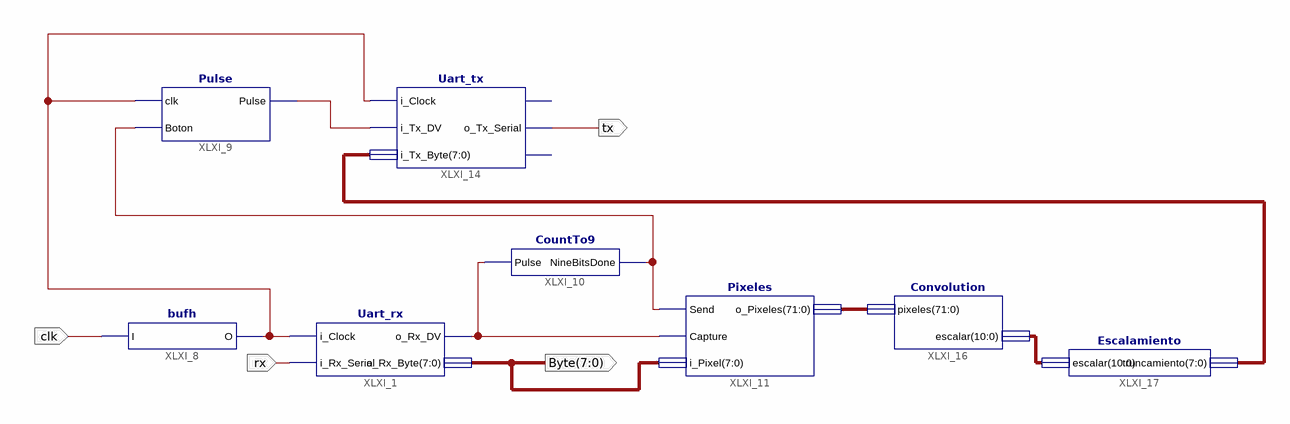
[diagram p0: schematic sheet 1]
// Xilinx ISE schematic Procesamiento.sch (spartan6) as structural Verilog: 8 symbols, 4 ports
module Procesamiento (
  input  rx,
  input  clk,
  output [7:0] Byte,
  output tx
);

  wire btn, Interrupt, XLXN_9, XLXN_10;
  wire [7:0] XLXN_21;
  wire [10:0] XLXN_22;
  wire [71:0] XLXN_16;

  Uart_rx XLXI_1 (.i_Clock(XLXN_9), .i_Rx_Serial(rx), .o_Rx_DV(Interrupt), .o_Rx_Byte(Byte));
  bufh XLXI_8 (.I(clk), .O(XLXN_9));
  Pulse XLXI_9 (.clk(XLXN_9), .Boton(btn), .Pulse(XLXN_10));
  CountTo9 XLXI_10 (.Pulse(Interrupt), .NineBitsDone(btn));
  Pixeles XLXI_11 (.Send(btn), .Capture(Interrupt), .i_Pixel(Byte), .o_Pixeles(XLXN_16));
  Uart_tx XLXI_14 (
    .i_Clock(XLXN_9), .i_Tx_DV(XLXN_10), .i_Tx_Byte(XLXN_21), .o_Tx_Serial(tx));  // open: o_Tx_Active, o_Tx_Done
  Convolution XLXI_16 (.pixeles(XLXN_16), .escalar(XLXN_22));
  Escalamiento XLXI_17 (.escalar(XLXN_22), .truncamiento(XLXN_21));
endmodule
